# EAGLE schematic PiezoTL072Preamp (EAGLE 7.7.0)
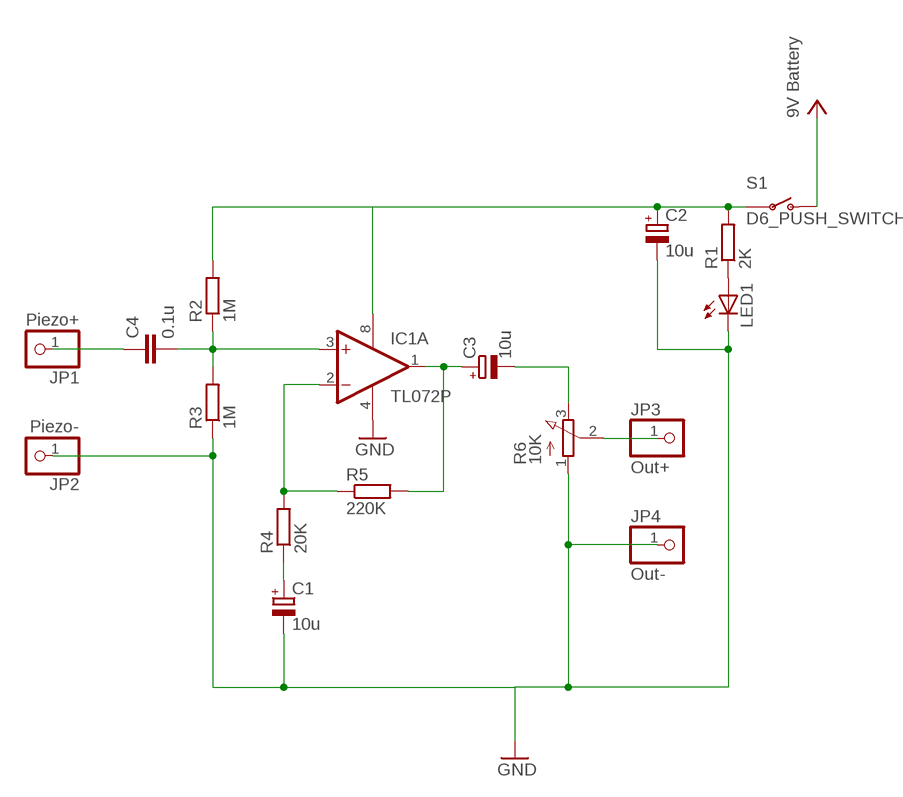
[diagram p0: schematic, sheet 1]

## Parts
C1  10u  CPOL-EUB45181B  [B45181B]
C2  10u  CPOL-EUB45181B  [B45181B]
C3  10u  CPOL-EUB45181B  [B45181B]
C4  0.1u  C-EU025-030X050  [C025-030X050]
IC1  TL072P  [DIL08]
JP1  Piezo+  PINHD-1X1  [1X01]
JP2  Piezo-  PINHD-1X1  [1X01]
JP3  Out+  PINHD-1X1  [1X01]
JP4  Out-  PINHD-1X1  [1X01]
LED1  LED5MM  [LED5MM]
R1  2K  R-EU_0204/7  [0204/7]
R2  1M  R-EU_0204/7  [0204/7]
R3  1M  R-EU_0204/7  [0204/7]
R4  20K  R-EU_0204/7  [0204/7]
R5  220K  R-EU_0204/7  [0204/7]
R6  10K  EVUF2A  [EVUF]
S1  D6_PUSH_SWITCH  [D6_PUSH_SWITCH]

## Nets
GND: C1.- C2.- IC1.4(P:V-) JP2.1 JP4.1 LED1.K(C) R3.1 R6.1(A)
N$1: C1.+ R4.1
N$2: IC1.2(A:-IN) R4.2 R5.1
N$3: LED1.A R1.1
N$4: C4.1 JP1.1
N$5: C4.2 IC1.3(A:+IN) R2.1 R3.2
N$7: C2.+ IC1.8(P:V+) R1.2 R2.2 S1.P$3(P) S1.P$4(P)
N$9: C3.+ IC1.1(A:OUT) R5.2
N$10: C3.- R6.3(E)
N$12: JP3.1 R6.2(S)
VCC: S1.P$1(O) S1.P$2(O) ; supply symbol labelled 9V Battery
Unconnected: IC1.5(B:+IN) IC1.6(B:-IN) IC1.7(B:OUT)

## Library data of the parts
C1-C3 = rcl:CPOL-EU: POLARIZED CAPACITOR, European symbol
C4 = rcl:C-EU: CAPACITOR, European symbol
IC1 = linear:TL072: OP AMP
JP1-JP4 = pinhead:PINHD-1X1: PIN HEADER
LED1 = led:LED: LED OSRAM: - CHIPLED LG R971, LG N971, LY N971, LG Q971, LY Q971, LO R971, LY R971 LH N974, LH R974 LS Q976, LO Q976, LY Q976 LO Q996 - Hyper CHIPLED LW Q18S LB Q993, LB Q99A, LB R99A - SideLED LS A670, LO A670, LY A670, LG A670, LP A670 LB A673, LV A673, LT A673, LW A673 LH A674 LY A675 LS A676, LA A676, LO A676, LY A676, LW A676 LS A679, LY A679, LG A679 - Hyper Micro SIDELED® LS Y876, LA Y876, LO Y876, LY Y876 LT Y87S - SmartLED LW L88C, LW L88S LB L89C, LB L89S, LG L890 LS L89K, LO L89K, LY L89K LS L896, LA L896, LO L896, LY L896 - TOPLED LS T670, LO T670, LY T670, LG T670, LP T670 LSG T670, LSP T670, LSY T670, LOP T670, LYG T670 LG T671, LOG T671, LSG T671 LB T673, LV T673, LT T673, LW T673 LH T674 LS T676, LA T676, LO T676, LY T676, LB T676, LH T676, LSB T676, LW T676 LB T67C, LV T67C, LT T67C, LS T67K, LO T67K, LY T67K, LW E67C LS E67B, LA E67B, LO E67B, LY E67B, LB E67C, LV E67C, LT E67C LW T67C LS T679, LY T679, LG T679 LS T770, LO T770, LY T770, LG T770, LP T770 LB T773, LV T773, LT T773, LW T773 LH T774 LS E675, LA E675, LY E675, LS T675 LS T776, LA T776, LO T776, LY T776, LB T776 LHGB T686 LT T68C, LB T68C - Hyper Mini TOPLED® LB M676 - Mini TOPLED Santana® LG M470 LS M47K, LO M47K, LY M47K Source: http://www.osram.convergy.de LUXEON: - LUMILED® LXK2-PW12-R00, LXK2-PW12-S00, LXK2-PW14-U00, LXK2-PW14-V00 LXK2-PM12-R00, LXK2-PM12-S00, LXK2-PM14-U00 LXK2-PE12-Q00, LXK2-PE12-R00, LXK2-PE12-S00, LXK2-PE14-T00, LXK2-PE14-U00 LXK2-PB12-K00, LXK2-PB12-L00, LXK2-PB12-M00, LXK2-PB14-N00, LXK2-PB14-P00, LXK2-PB14-Q00 LXK2-PR12-L00, LXK2-PR12-M00, LXK2-PR14-Q00, LXK2-PR14-R00 LXK2-PD12-Q00, LXK2-PD12-R00, LXK2-PD12-S00 LXK2-PH12-R00, LXK2-PH12-S00 LXK2-PL12-P00, LXK2-PL12-Q00, LXK2-PL12-R00 Source: www.luxeon.com KINGBRIGHT: KA-3528ASYC Source: www.kingbright.com
R1-R5 = rcl:R-EU_: RESISTOR, European symbol
R6 = pot:EVU: 9 mm Square Rotary Potentiometers Source: Panasonic
S1 = MusicThingModular:D6_PUSH_SWITCH: Push switch